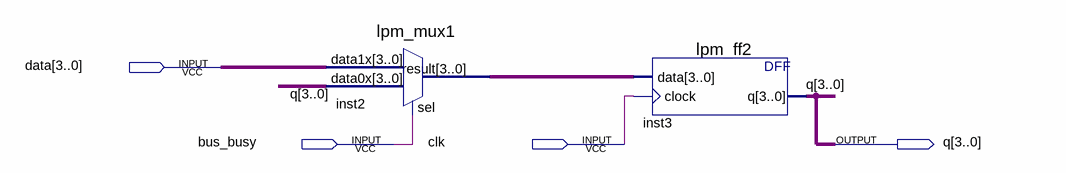
[diagram p0: schematic sheet]
// Quartus schematic slave.bdf as structural Verilog: 2 symbols, 4 pins
module slave (
  input  [3:0] data,
  input  bus_busy,
  input  clk,
  output [3:0] q
);

  wire [3:0] inst2_result;

  lpm_mux1 inst2 (.data1x(data), .data0x(q), .sel(bus_busy), .result(inst2_result));
  lpm_ff2 inst3 (.data(inst2_result), .clock(clk), .q(q));
endmodule
